# EAGLE schematic scheme (EAGLE 7.2.0)
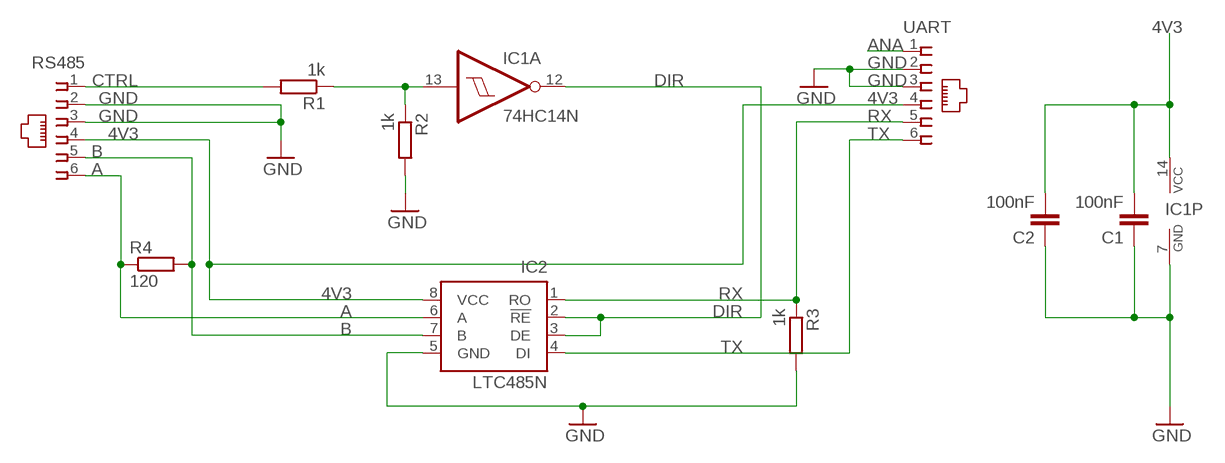
[diagram p0: schematic, sheet 1]

## Parts
C1  100nF  C-EU050-024X044  [C050-024X044]
C2  100nF  C-EU050-024X044  [C050-024X044]
IC1  74HC14N  [DIL14]
IC2  LTC485N  [DIL08]
R1  1k  R-EU_0204/7  [0204/7]
R2  1k  R-EU_0204/7  [0204/7]
R3  1k  R-EU_0204/7  [0204/7]
R4  120  R-EU_0204/7  [0204/7]
RS485  NXT  [NXT]
UART  NXT  [NXT]

## Nets
4V3: C1.2 C2.2 IC1.14(P:VCC) IC2.8(VCC) RS485.4 UART.4
A: IC2.6(A) R4.1 RS485.6
ANA: UART.1
B: IC2.7(B) R4.2 RS485.5
CTRL: R1.2 RS485.1
DIR: IC1.12(A:O) IC2.2(!RE) IC2.3(DE)
GND: C1.1 C2.1 IC1.7(P:GND) IC2.5(GND) R2.2 R3.2 RS485.2 RS485.3 UART.2 UART.3
N$1: IC1.13(A:I) R1.1 R2.1
RX: IC2.1(RO) R3.1 UART.5
TX: IC2.4(DI) UART.6
Unconnected: IC1.1(D:I) IC1.2(D:O) IC1.3(E:I) IC1.4(E:O) IC1.5(F:I) IC1.6(F:O) IC1.8(C:O) IC1.9(C:I) IC1.10(B:O) IC1.11(B:I)

## Library data of the parts
C1 C2 = rcl:C-EU: CAPACITOR, European symbol
IC1 = 74xx-eu:74*14: Hex schmitt trigger INVERTER
IC2 = linear-technology:LTC485: Low Power RS485 Interface Transceiver Source: http://www.linear.com/pc/downloadDocument.do?navId=H0,C1,C1007,C1017,P2064,D1718; OC_FARNELL: unknown; OC_NEWARK: unknown
R1-R4 = rcl:R-EU_: RESISTOR, European symbol
RS485 UART = NXT:NXT: 6 Pin RJ-12 Connector for Lego Mindstorms NXT 6/6 Western Telephone Jack